# Altium schematic sheet servo_driver_and_imu_device.SchDoc
size A4
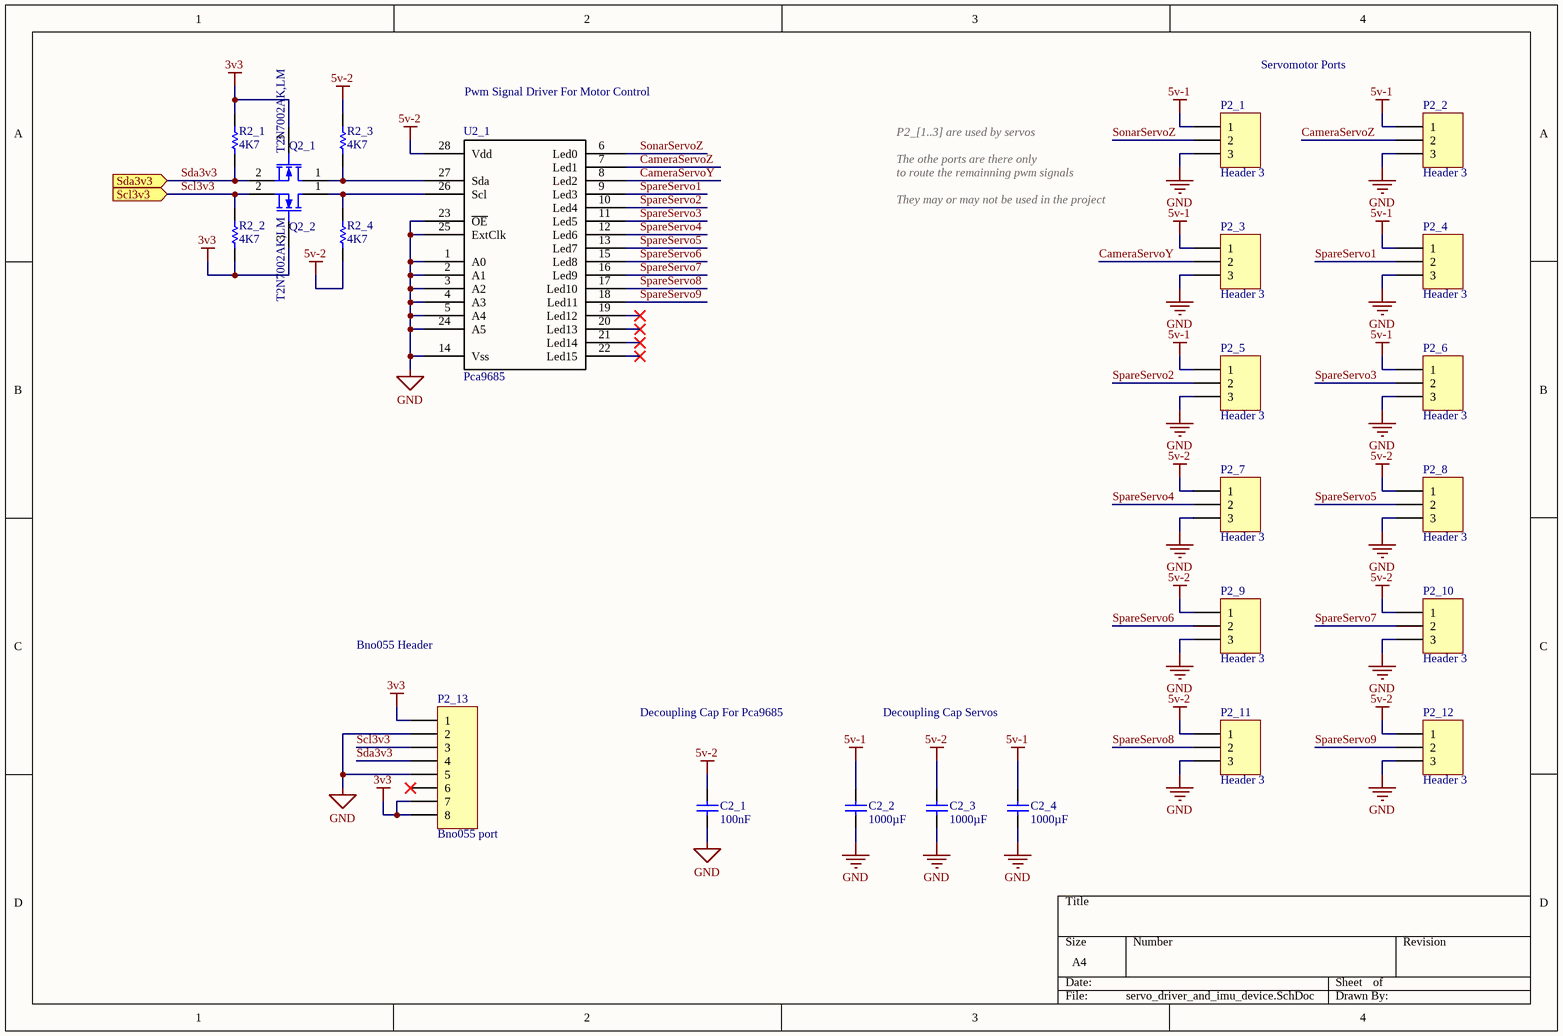
[diagram p0: servo_driver_and_imu_device.SchDoc]

## Parts
C2_1  value 100nF  [C1206]  (hidden comment: 12063C104MAT2A)
C2_2  value 1000µF  [CAP-ELECTRO-KE0]  (hidden comment: EMHS250GRA102MKE0S)
C2_3  value 1000µF  [CAP-ELECTRO-KE0]  (hidden comment: EMHS250GRA102MKE0S)
C2_4  value 1000µF  [CAP-ELECTRO-KE0]  (hidden comment: EMHS250GRA102MKE0S)
P2_1  Header 3  [HDR1X3-42]
P2_2  Header 3  [HDR1X3-42]
P2_3  Header 3  [HDR1X3-42]
P2_4  Header 3  [HDR1X3-42]
P2_5  Header 3  [HDR1X3-42]
P2_6  Header 3  [HDR1X3-42]
P2_7  Header 3  [HDR1X3-42]
P2_8  Header 3  [HDR1X3-42]
P2_9  Header 3  [HDR1X3-42]
P2_10  Header 3  [HDR1X3-42]
P2_11  Header 3  [HDR1X3-42]
P2_12  Header 3  [HDR1X3-42]
P2_13  Bno055 port  [HDR1X8-42]
Q2_1  T2N7002AK,LM  [SOT23_L]
Q2_2  T2N7002AK,LM  [SOT23_L]
R2_1  value 4K7  [C1206]  (hidden comment: Res1)
R2_2  value 4K7  [C1206]  (hidden comment: Res1)
R2_3  value 4K7  [C1206]  (hidden comment: Res1)
R2_4  value 4K7  [C1206]  (hidden comment: Res1)
U2_1  Pca9685  [SOP65P640X110-28N]

## Ports
Scl3v3 (in), Sda3v3 (in)

## Nets
3v3: P2_13.1 P2_13.7 P2_13.8 Q2_1.3(G) Q2_2.3(G) R2_1.1 R2_2.2
5v-1: C2_2.1 C2_4.1 P2_1.1 P2_2.1 P2_3.1 P2_4.1 P2_5.1 P2_6.1
5v-2: C2_1.1 C2_3.1 P2_7.1 P2_8.1 P2_9.1 P2_10.1 P2_11.1 P2_12.1 R2_3.1 R2_4.2 U2_1.28(Vdd)
GND: C2_1.2 C2_2.2 C2_3.2 C2_4.2 P2_1.3 P2_2.3 P2_3.3 P2_4.3 P2_5.3 P2_6.3 P2_7.3 P2_8.3 P2_9.3 P2_10.3 P2_11.3 P2_12.3 P2_13.2 P2_13.5 U2_1.1(A0) U2_1.2(A1) U2_1.3(A2) U2_1.4(A3) U2_1.5(A4) U2_1.14(Vss) U2_1.23(~{OE}) U2_1.24(A5) U2_1.25(ExtClk)
CameraServoY: P2_3.2 U2_1.8(Led2)
CameraServoZ: P2_2.2 U2_1.7(Led1)
Scl3v3: P2_13.3 Q2_2.2(S) R2_2.1 ; port Scl3v3
Sda3v3: P2_13.4 Q2_1.2(S) R2_1.2 ; port Sda3v3
SonarServoZ: P2_1.2 U2_1.6(Led0)
SpareServo1: P2_4.2 U2_1.9(Led3)
SpareServo2: P2_5.2 U2_1.10(Led4)
SpareServo3: P2_6.2 U2_1.11(Led5)
SpareServo4: P2_7.2 U2_1.12(Led6)
SpareServo5: P2_8.2 U2_1.13(Led7)
SpareServo6: P2_9.2 U2_1.15(Led8)
SpareServo7: P2_10.2 U2_1.16(Led9)
SpareServo8: P2_11.2 U2_1.17(Led10)
SpareServo9: P2_12.2 U2_1.18(Led11)
NetQ2_1_1: Q2_1.1(D) R2_3.2 U2_1.27(Sda)
NetQ2_2_1: Q2_2.1(D) R2_4.1 U2_1.26(Scl)

Not connected (* = marked no-connect by the designer): P2_13 6*; U2_1 19(Led12)* 20(Led13)* 21(Led14)* 22(Led15)*

## Notes on the sheet
- Pwm Signal Driver For Motor Control
- Servomotor Ports
- P2_[1..3] are used by servos
- The othe ports are there only
- to route the remainning pwm signals
- They may or may not be used in the project
- Bno055 Header
- Decoupling Cap For Pca9685
- Decoupling Cap Servos

## Library data of the parts
C2_1-C2_4 = Cap: Capacitor; Published: 8-Jun-2000; LatestRevisionDate: 17-Jul-2002; LatestRevisionNote: Re-released for DXP Platform.; PackageReference: RAD-0.3; Publisher: Altium Limited; PackageDescription: Radial Cap, Thru-Hole; 2 Leads; 0.3 in Pin Spacing
P2_1-P2_12 = Header 3: Header, 3-Pin; LatestRevisionDate: 17-Jul-2002; LatestRevisionNote: Re-released for DXP Platform.; Publisher: Altium Limited
P2_13 = Header 8: Header, 8-Pin; LatestRevisionDate: 17-Jul-2002; LatestRevisionNote: Re-released for DXP Platform.; Publisher: Altium Limited
Q2_1 Q2_2 = MOSFET-N: N-Channel MOSFET; Published: 8-Jun-2000; LatestRevisionDate: 17-Jul-2002; LatestRevisionNote: Re-released for DXP Platform.; PackageVersion: 1995/1996; PackageReference: E3; Publisher: Altium Limited; PackageDescription: TO, Flat Index; 3 In-Line, Axial Leads; Body Dia. 4.6mm; Lead Dia. 0.5 mm (max)
R2_1-R2_4 = Res1: Resistor; Published: 8-Jun-2000; LatestRevisionDate: 17-Jul-2002; LatestRevisionNote: Re-released for DXP Platform.; PackageReference: AXIAL-0.3; Publisher: Altium Limited; PackageDescription: Axial Device, Thru-Hole; 2 Leads; 0.3 in Pin Spacing
U2_1 = Pca9685: Serial pwm led driver